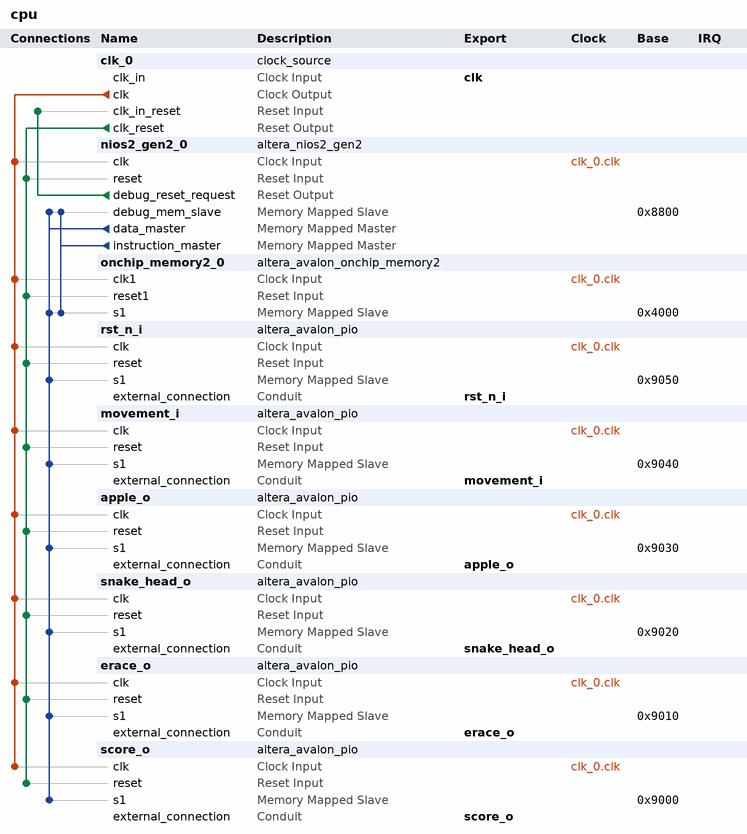
[diagram p0: system contents]
# Platform Designer (Qsys) system cpu, Cyclone IV E EP4CE6E22C8
# Parameters at their usual value, and those the tool derives, are not listed.
package require -exact qsys 20.1
create_system cpu
set_project_property DEVICE_FAMILY {Cyclone IV E}
set_project_property DEVICE EP4CE6E22C8

add_instance clk_0 clock_source 20.1
set_instance_parameter_value clk_0 clockFrequency 50000000

add_instance nios2_gen2_0 altera_nios2_gen2 20.1
set_instance_parameter_value nios2_gen2_0 dcache_size 2048
set_instance_parameter_value nios2_gen2_0 exceptionSlave onchip_memory2_0.s1
set_instance_parameter_value nios2_gen2_0 icache_size 4096
set_instance_parameter_value nios2_gen2_0 impl Tiny
set_instance_parameter_value nios2_gen2_0 resetSlave onchip_memory2_0.s1

add_instance onchip_memory2_0 altera_avalon_onchip_memory2 20.1
set_instance_parameter_value onchip_memory2_0 dataWidth 32
set_instance_parameter_value onchip_memory2_0 dualPort false
set_instance_parameter_value onchip_memory2_0 initMemContent true
set_instance_parameter_value onchip_memory2_0 initializationFileName onchip_mem.hex
set_instance_parameter_value onchip_memory2_0 memorySize 16384

add_instance rst_n_i altera_avalon_pio 20.1
set_instance_parameter_value rst_n_i direction Input
set_instance_parameter_value rst_n_i width 1

add_instance movement_i altera_avalon_pio 20.1
set_instance_parameter_value movement_i direction Input
set_instance_parameter_value movement_i width 2

add_instance apple_o altera_avalon_pio 20.1
set_instance_parameter_value apple_o direction Output
set_instance_parameter_value apple_o width 16

add_instance snake_head_o altera_avalon_pio 20.1
set_instance_parameter_value snake_head_o direction Output
set_instance_parameter_value snake_head_o width 16

add_instance erace_o altera_avalon_pio 20.1
set_instance_parameter_value erace_o direction Output
set_instance_parameter_value erace_o width 16

add_instance score_o altera_avalon_pio 20.1
set_instance_parameter_value score_o direction Output
set_instance_parameter_value score_o width 8

# connections
add_connection clk_0.clk apple_o.clk clock
add_connection clk_0.clk erace_o.clk clock
add_connection clk_0.clk movement_i.clk clock
add_connection clk_0.clk nios2_gen2_0.clk clock
add_connection clk_0.clk onchip_memory2_0.clk1 clock
add_connection clk_0.clk rst_n_i.clk clock
add_connection clk_0.clk score_o.clk clock
add_connection clk_0.clk snake_head_o.clk clock
add_connection clk_0.clk_reset apple_o.reset reset
add_connection clk_0.clk_reset erace_o.reset reset
add_connection clk_0.clk_reset movement_i.reset reset
add_connection clk_0.clk_reset nios2_gen2_0.reset reset
add_connection clk_0.clk_reset onchip_memory2_0.reset1 reset
add_connection clk_0.clk_reset rst_n_i.reset reset
add_connection clk_0.clk_reset score_o.reset reset
add_connection clk_0.clk_reset snake_head_o.reset reset
add_connection nios2_gen2_0.debug_reset_request clk_0.clk_in_reset reset
add_connection nios2_gen2_0.data_master apple_o.s1 avalon
set_connection_parameter_value nios2_gen2_0.data_master/apple_o.s1 baseAddress 0x9030
add_connection nios2_gen2_0.data_master erace_o.s1 avalon
set_connection_parameter_value nios2_gen2_0.data_master/erace_o.s1 baseAddress 0x9010
add_connection nios2_gen2_0.data_master movement_i.s1 avalon
set_connection_parameter_value nios2_gen2_0.data_master/movement_i.s1 baseAddress 0x9040
add_connection nios2_gen2_0.data_master nios2_gen2_0.debug_mem_slave avalon
set_connection_parameter_value nios2_gen2_0.data_master/nios2_gen2_0.debug_mem_slave baseAddress 0x8800
add_connection nios2_gen2_0.data_master onchip_memory2_0.s1 avalon
set_connection_parameter_value nios2_gen2_0.data_master/onchip_memory2_0.s1 baseAddress 0x4000
add_connection nios2_gen2_0.data_master rst_n_i.s1 avalon
set_connection_parameter_value nios2_gen2_0.data_master/rst_n_i.s1 baseAddress 0x9050
add_connection nios2_gen2_0.data_master score_o.s1 avalon
set_connection_parameter_value nios2_gen2_0.data_master/score_o.s1 baseAddress 0x9000
add_connection nios2_gen2_0.data_master snake_head_o.s1 avalon
set_connection_parameter_value nios2_gen2_0.data_master/snake_head_o.s1 baseAddress 0x9020
add_connection nios2_gen2_0.instruction_master nios2_gen2_0.debug_mem_slave avalon
set_connection_parameter_value nios2_gen2_0.instruction_master/nios2_gen2_0.debug_mem_slave baseAddress 0x8800
add_connection nios2_gen2_0.instruction_master onchip_memory2_0.s1 avalon
set_connection_parameter_value nios2_gen2_0.instruction_master/onchip_memory2_0.s1 baseAddress 0x4000

# exported interfaces
add_interface apple_o conduit end
set_interface_property apple_o EXPORT_OF apple_o.external_connection
add_interface clk clock sink
set_interface_property clk EXPORT_OF clk_0.clk_in
add_interface erace_o conduit end
set_interface_property erace_o EXPORT_OF erace_o.external_connection
add_interface movement_i conduit end
set_interface_property movement_i EXPORT_OF movement_i.external_connection
add_interface rst_n_i conduit end
set_interface_property rst_n_i EXPORT_OF rst_n_i.external_connection
add_interface score_o conduit end
set_interface_property score_o EXPORT_OF score_o.external_connection
add_interface snake_head_o conduit end
set_interface_property snake_head_o EXPORT_OF snake_head_o.external_connection

set_interconnect_requirement {$system} qsys_mm.clockCrossingAdapter HANDSHAKE
set_interconnect_requirement {$system} qsys_mm.enableEccProtection FALSE
set_interconnect_requirement {$system} qsys_mm.insertDefaultSlave FALSE
set_interconnect_requirement {$system} qsys_mm.maxAdditionalLatency 1

save_system cpu.qsys
